# EAGLE design finis (EAGLE 9.6.2)
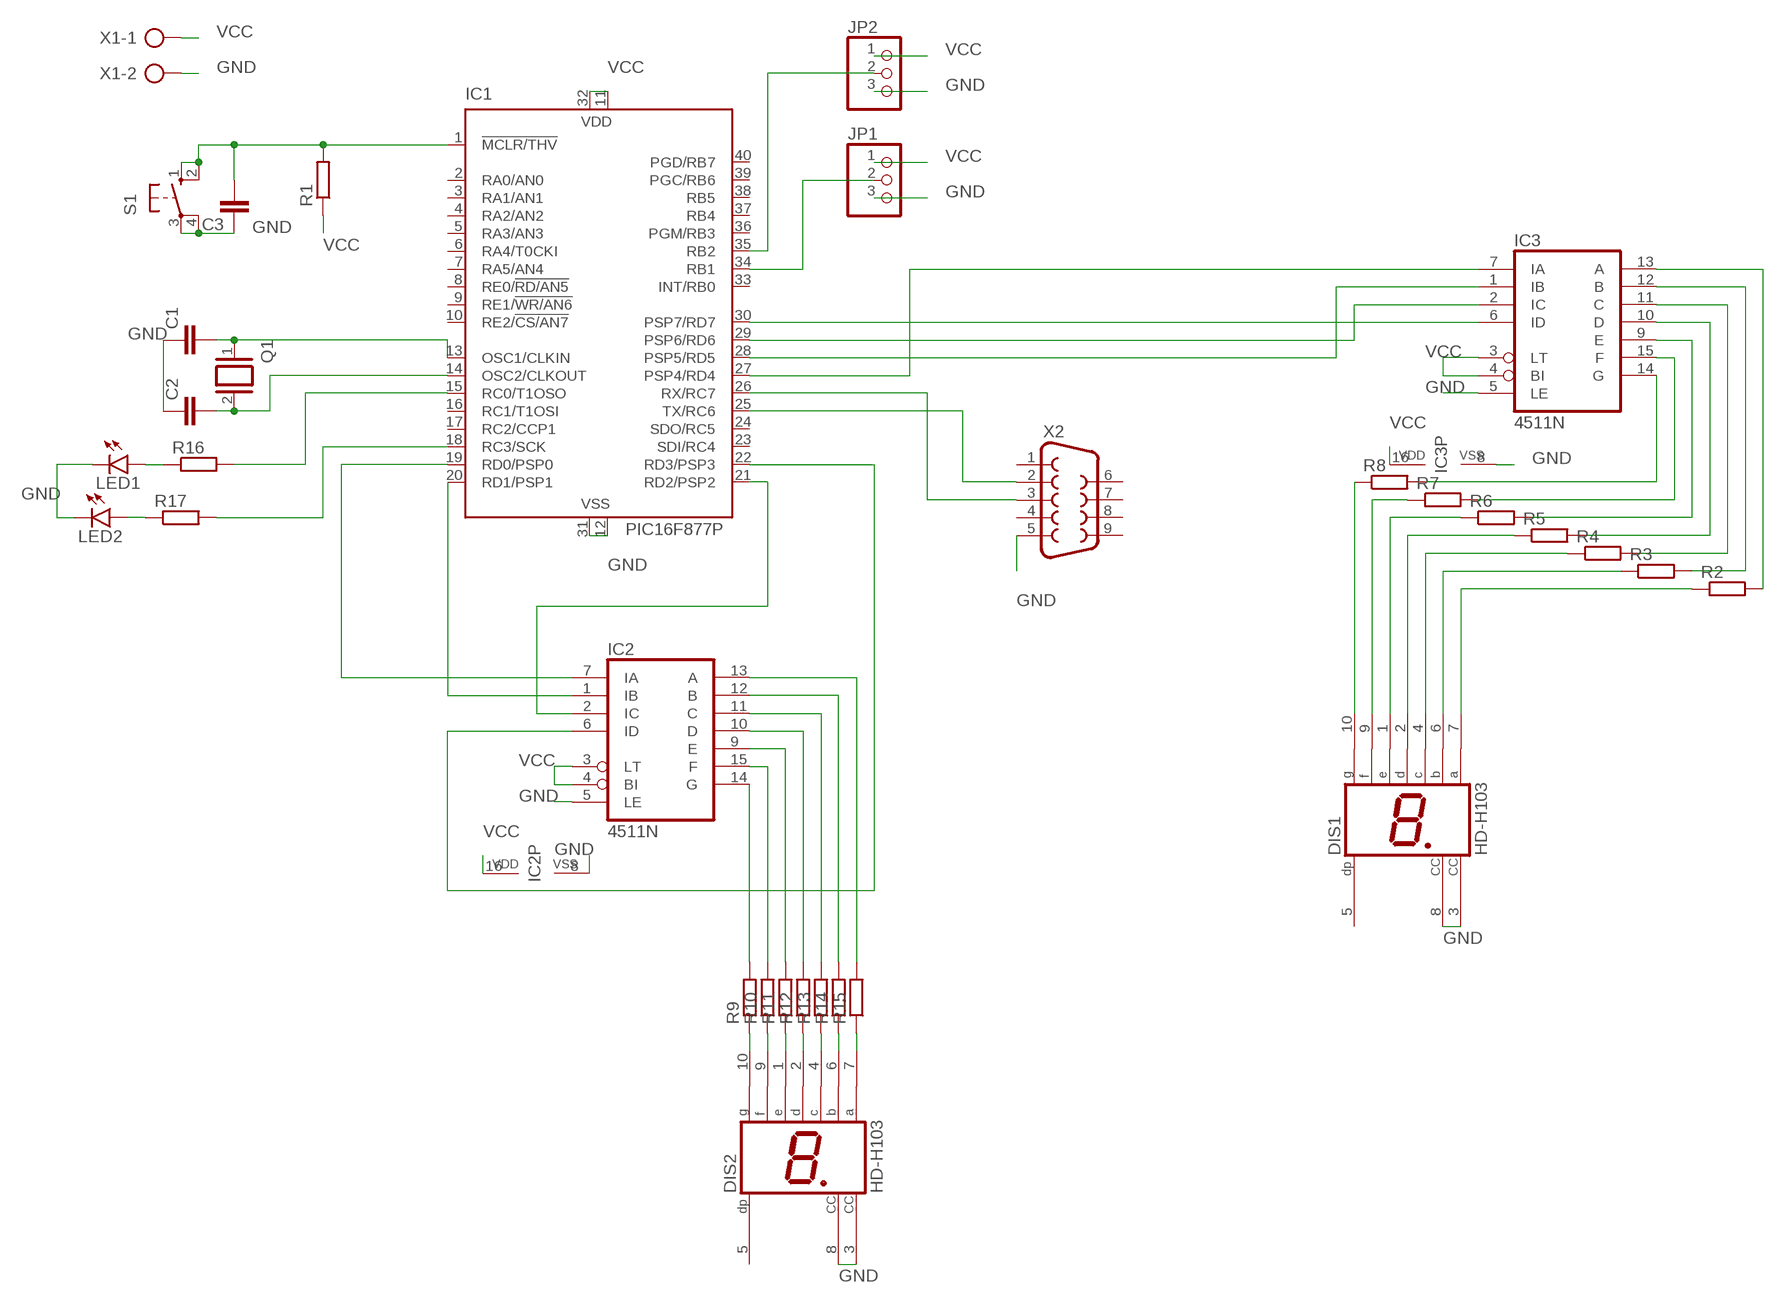
[diagram p0: schematic, sheet 1]

## Parts
C1  C-EU025-025X050  [C025-025X050]
C2  C-EU025-025X050  [C025-025X050]
C3  C-EU025-025X050  [C025-025X050]
DIS1  HD-H103  [HDSP-M]
DIS2  HD-H103  [HDSP-M]
IC1  PIC16F877P  [DIL40]
IC2  4511N  [DIL16]
IC3  4511N  [DIL16]
JP1  PINHD-1X3  [1X03]
JP2  PINHD-1X3  [1X03]
LED1  LED5MM  [LED5MM]
LED2  LED5MM  [LED5MM]
Q1  XTAL/S  [QS]
R1  R-EU_0207/10  [0207/10]
R2  R-EU_0207/10  [0207/10]
R3  R-EU_0207/10  [0207/10]
R4  R-EU_0207/10  [0207/10]
R5  R-EU_0207/10  [0207/10]
R6  R-EU_0207/10  [0207/10]
R7  R-EU_0207/10  [0207/10]
R8  R-EU_0207/10  [0207/10]
R9  R-EU_0207/10  [0207/10]
R10  R-EU_0207/10  [0207/10]
R11  R-EU_0207/10  [0207/10]
R12  R-EU_0207/10  [0207/10]
R13  R-EU_0207/10  [0207/10]
R14  R-EU_0207/10  [0207/10]
R15  R-EU_0207/10  [0207/10]
R16  R-EU_0207/10  [0207/10]
R17  R-EU_0207/10  [0207/10]
S1  10-XX  [B3F-10XX]
X1  AK300/2  [AK300/2]
X2  F09H  [F09H]

## Nets
GND: C1.1 C2.1 C3.1 DIS1.3(CC) DIS1.8(CC) DIS2.3(CC) DIS2.8(CC) IC1.12(VSS) IC1.31(VSS) IC2.5(LE) IC2.8(VSS) IC3.5(LE) IC3.8(VSS) JP1.3 JP2.3 LED1.K(C) LED2.K(C) S1.3(P) S1.4(P1) X1.2 X2.5
N$1: C1.2 IC1.13(OSC1/CLKIN) Q1.1
N$2: C2.2 IC1.14(OSC2/CLKOUT) Q1.2
N$3: C3.2 IC1.1(!MCLR/THV) R1.2 S1.1(S) S1.2(S1)
N$4: IC1.19(RD0/PSP0) IC2.7(IA)
N$5: IC1.20(RD1/PSP1) IC2.1(IB)
N$6: IC2.2(IC)
N$7: IC1.22(RD3/PSP3) IC2.6(ID)
N$8: IC1.21(RD2/PSP2)
N$9: IC1.27(PSP4/RD4) IC3.7(IA)
N$10: IC1.28(PSP5/RD5) IC3.1(IB)
N$11: IC1.29(PSP6/RD6) IC3.2(IC)
N$12: IC1.30(PSP7/RD7) IC3.6(ID)
N$13: IC3.13(A) R2.2
N$14: IC3.12(B) R3.2
N$15: IC3.11(C) R4.2
N$16: IC3.10(D) R5.2
N$17: IC3.9(E) R6.2
N$18: DIS1.9(F) R7.1
N$19: DIS1.10(G) R8.1
N$20: DIS1.7(A) R2.1
N$21: DIS1.6(B) R3.1
N$22: DIS1.4(C) R4.1
N$23: DIS1.2(D) R5.1
N$24: DIS1.1(E) R6.1
N$25: IC3.15(F) R7.2
N$26: IC3.14(G) R8.2
N$27: DIS2.10(G) R9.1
N$28: DIS2.9(F) R10.1
N$29: DIS2.1(E) R11.1
N$30: DIS2.2(D) R12.1
N$31: DIS2.4(C) R13.1
N$32: DIS2.6(B) R14.1
N$33: DIS2.7(A) R15.1
N$34: IC2.14(G) R9.2
N$35: IC2.15(F) R10.2
N$36: IC2.9(E) R11.2
N$37: IC2.10(D) R12.2
N$38: IC2.11(C) R13.2
N$39: IC2.12(B) R14.2
N$40: IC2.13(A) R15.2
N$41: LED1.A R16.1
N$42: LED2.A R17.1
N$43: IC1.18(RC3/SCK) R17.2
N$44: IC1.15(RC0/T1OSO) R16.2
N$45: IC1.25(TX/RC6) X2.2
N$46: IC1.26(RX/RC7) X2.3
N$47: IC1.35(RB2) JP2.2
N$48: IC1.34(RB1) JP1.2
VCC: IC1.11(VDD) IC1.32(VDD) IC2.3(LT) IC2.4(BI) IC2.16(VDD) IC3.3(LT) IC3.4(BI) IC3.16(VDD) JP1.1 JP2.1 R1.1 X1.1
Unconnected: DIS1.5(DP) DIS2.5(DP) IC1.2(RA0/AN0) IC1.3(RA1/AN1) IC1.4(RA2/AN2) IC1.5(RA3/AN3) IC1.6(RA4/T0CKI) IC1.7(RA5/AN4) IC1.8(RE0/!RD/AN5) IC1.9(RE1/!WR/AN6) IC1.10(RE2/!CS/AN7) IC1.16(RC1/T1OSI) IC1.17(RC2/CCP1) IC1.23(SDI/RC4) IC1.24(SDO/RC5) IC1.33(INT/RB0) IC1.36(PGM/RB3) IC1.37(RB4) IC1.38(RB5) IC1.39(PGC/RB6) IC1.40(PGD/RB7) X2.1 X2.4 X2.6 X2.7 X2.8 X2.9

## Library data of the parts
C1-C3 = rcl:C-EU: CAPACITOR, European symbol; SPICEPREFIX: C
DIS1 DIS2 = display-hp:HD-H103: LED DISPLAY 1-character 7 segment, decimal point right; OC_FARNELL: unknown; OC_NEWARK: unknown
IC1 = microchip:PIC16F87*: MICROCONTROLLER; MF: MICROCHIP; MPN: PIC16F877-04/P; OC_FARNELL: 9761349; OC_NEWARK: 61K3463
IC2 IC3 = 45xx:4511: BCD to 7-segment LATCH/DECODER/DRIVER
JP1 JP2 = pinhead:PINHD-1X3: PIN HEADER
LED1 LED2 = led:LED: LED OSRAM: - CHIPLED LG R971, LG N971, LY N971, LG Q971, LY Q971, LO R971, LY R971 LH N974, LH R974 LS Q976, LO Q976, LY Q976 LO Q996 - Hyper CHIPLED LW Q18S LB Q993, LB Q99A, LB R99A - SideLED LS A670, LO A670, LY A670, LG A670, LP A670 LB A673, LV A673, LT A673, LW A673 LH A674 LY A675 LS A676, LA A676, LO A676, LY A676, LW A676 LS A679, LY A679, LG A679 - Hyper Micro SIDELED® LS Y876, LA Y876, LO Y876, LY Y876 LT Y87S - SmartLED LW L88C, LW L88S LB L89C, LB L89S, LG L890 LS L89K, LO L89K, LY L89K LS L896, LA L896, LO L896, LY L896 - TOPLED LS T670, LO T670, LY T670, LG T670, LP T670 LSG T670, LSP T670, LSY T670, LOP T670, LYG T670 LG T671, LOG T671, LSG T671 LB T673, LV T673, LT T673, LW T673 LH T674 LS T676, LA T676, LO T676, LY T676, LB T676, LH T676, LSB T676, LW T676 LB T67C, LV T67C, LT T67C, LS T67K, LO T67K, LY T67K, LW E67C LS E67B, LA E67B, LO E67B, LY E67B, LB E67C, LV E67C, LT E67C LW T67C LS T679, LY T679, LG T679 LS T770, LO T770, LY T770, LG T770, LP T770 LB T773, LV T773, LT T773, LW T773 LH T774 LS E675, LA E675, LY E675, LS T675 LS T776, LA T776, LO T776, LY T776, LB T776 LHGB T686 LT T68C, LB T68C - Hyper Mini TOPLED® LB M676 - Mini TOPLED Santana® LG M470 LS M47K, LO M47K, LY M47K Source: http://www.osram.convergy.de LUXEON: - LUMILED® LXK2-PW12-R00, LXK2-PW12-S00, LXK2-PW14-U00, LXK2-PW14-V00 LXK2-PM12-R00, LXK2-PM12-S00, LXK2-PM14-U00 LXK2-PE12-Q00, LXK2-PE12-R00, LXK2-PE12-S00, LXK2-PE14-T00, LXK2-PE14-U00 LXK2-PB12-K00, LXK2-PB12-L00, LXK2-PB12-M00, LXK2-PB14-N00, LXK2-PB14-P00, LXK2-PB14-Q00 LXK2-PR12-L00, LXK2-PR12-M00, LXK2-PR14-Q00, LXK2-PR14-R00 LXK2-PD12-Q00, LXK2-PD12-R00, LXK2-PD12-S00 LXK2-PH12-R00, LXK2-PH12-S00 LXK2-PL12-P00, LXK2-PL12-Q00, LXK2-PL12-R00 Source: www.luxeon.com KINGBRIGHT: KA-3528ASYC Source: www.kingbright.com
Q1 = special:XTAL/S: CRYSTAL
R1-R17 = rcl:R-EU_: RESISTOR, European symbol; SPICEPREFIX: R
S1 = switch-omron:10-XX: OMRON SWITCH; MPN: B3F-1000; OC_FARNELL: 176432; OC_NEWARK: 36M3542
X1 = con-ptr500:AK300/2: CONNECTOR; OC_FARNELL: unknown; OC_NEWARK: unknown
X2 = con-subd:F09: SUB-D; OC_FARNELL: unknown; OC_NEWARK: unknown

## Board
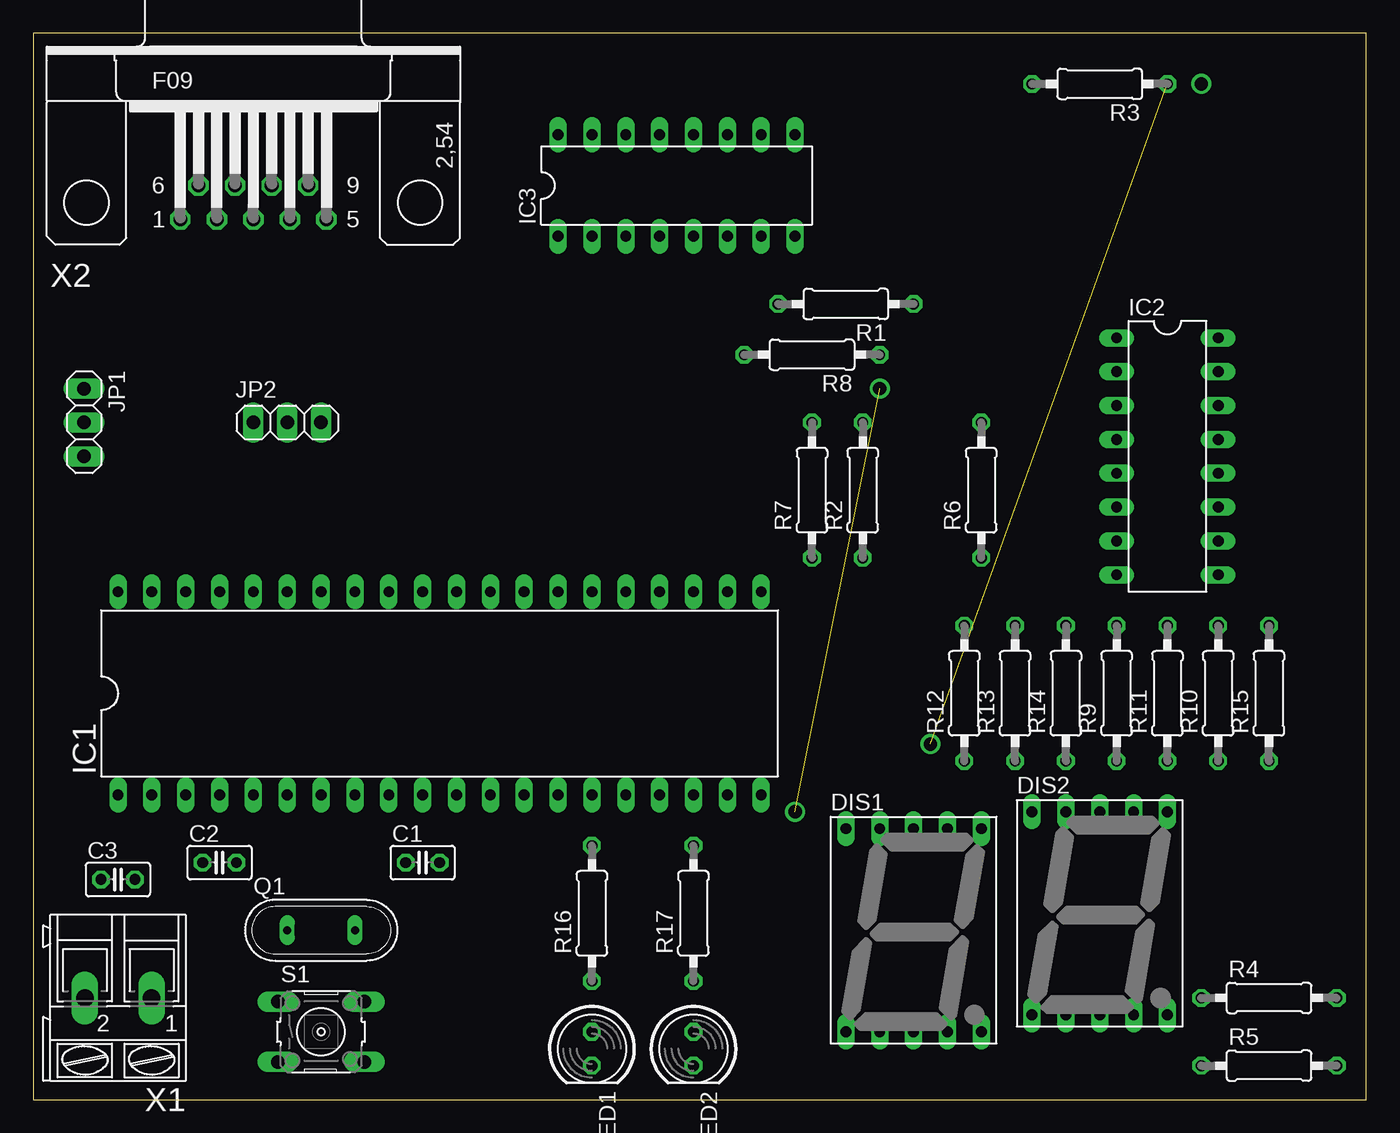
[diagram p1: board, top side]
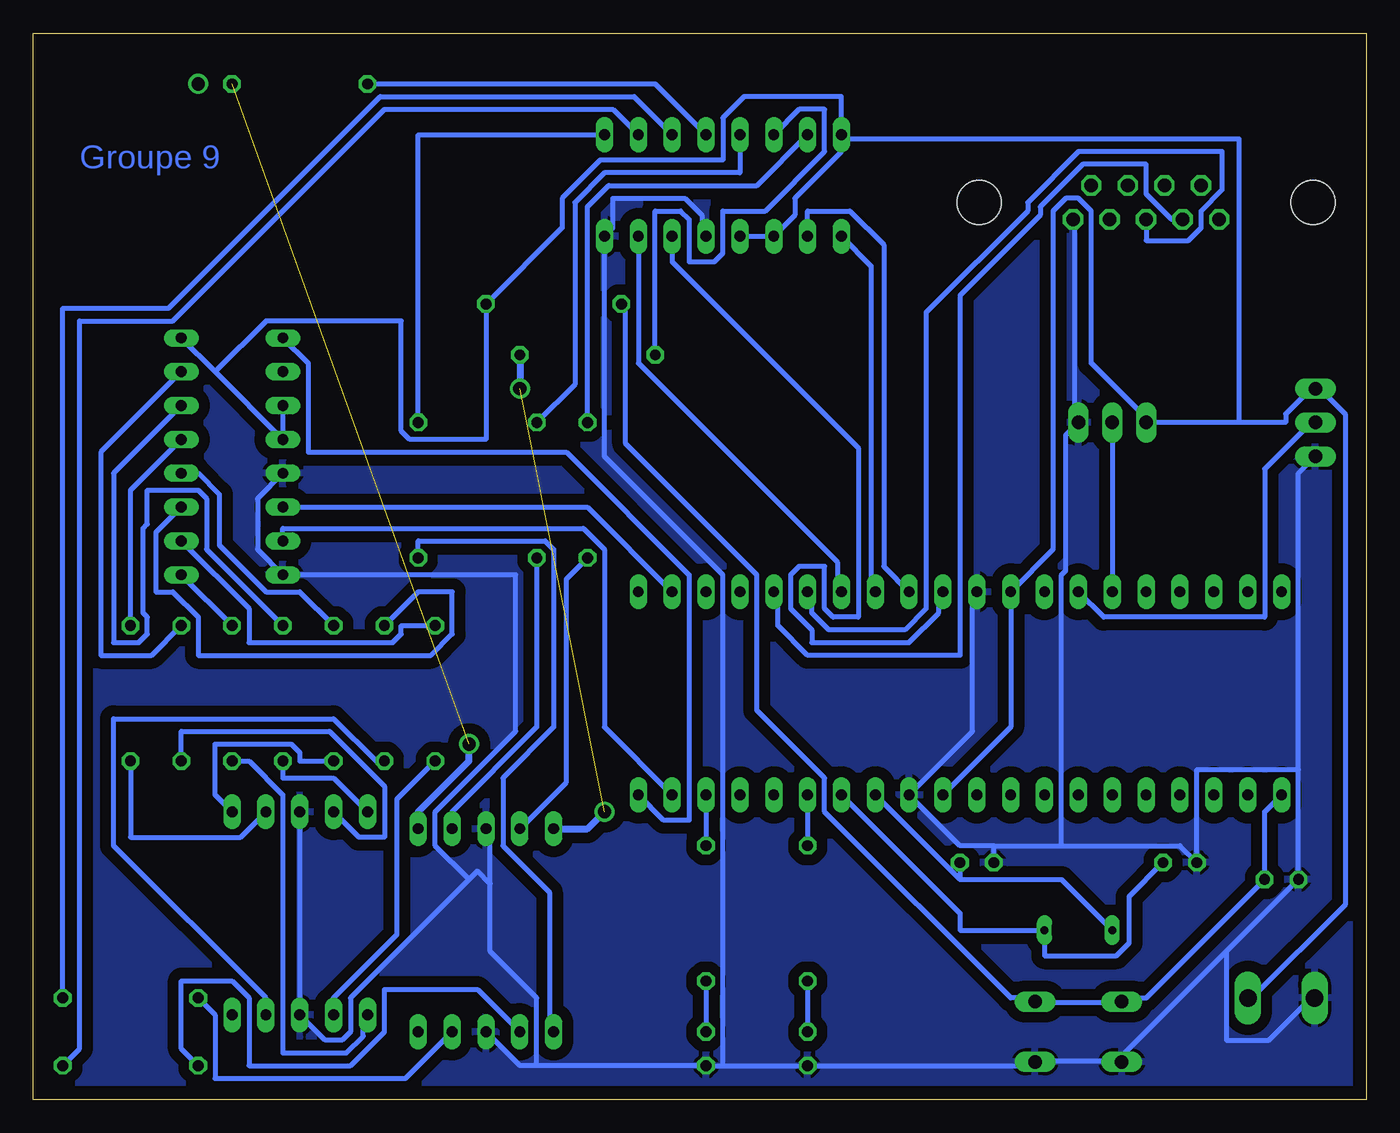
[diagram p2: board, bottom side, seen from below]

Size 100 x 80 mm. Coordinates in mm from the lower left corner, seen from the top.
Outline: 0,0 100,0 100,80 0,80 0,0
Copper layers (1*16): Top 0.035mm / dielectric 1.5mm / Bottom 0.035mm
Design rules "default *": minimum track width 15mil, minimum drill 0.35mm, track to track 15mil, track to pad 15mil, pad to pad 15mil, via to via 15mil, smd to smd 6mil, copper to edge 40mil, drill to drill 6mil, minimum pad ring 10mil, minimum via ring 8mil, stop-mask expansion 4mil, vias tented up to drill 0mil, thermal gap 10mil

### Footprints (pad centres in the part's own frame; a part is rotated, then mirrored left to right if it is on the bottom)
C025-025X050 = drill 0.813 octagon: 1 -1.27,0; 2 1.27,0
HDSP-M = drill 0.813 long: 1 -5.08,-7.62; 2 -2.54,-7.62; 3 0,-7.62; 4 2.54,-7.62; 5 5.08,-7.62; 6 5.08,7.62; 7 2.54,7.62; 8 0,7.62; 9 -2.54,7.62; 10 -5.08,7.62
DIL40 = drill 0.813 long: 1 -24.13,-7.62; 2 -21.59,-7.62; 3 -19.05,-7.62; 4 -16.51,-7.62; 5 -13.97,-7.62; 6 -11.43,-7.62; 7 -8.89,-7.62; 8 -6.35,-7.62; 9 -3.81,-7.62; 10 -1.27,-7.62; 11 1.27,-7.62; 12 3.81,-7.62; 13 6.35,-7.62; 14 8.89,-7.62; 15 11.43,-7.62; 16 13.97,-7.62; 17 16.51,-7.62; 18 19.05,-7.62; 19 21.59,-7.62; 20 24.13,-7.62; 21 24.13,7.62; 22 21.59,7.62; 23 19.05,7.62; 24 16.51,7.62; 25 13.97,7.62; 26 11.43,7.62; 27 8.89,7.62; 28 6.35,7.62; 29 3.81,7.62; 30 1.27,7.62; 31 -1.27,7.62; 32 -3.81,7.62; 33 -6.35,7.62; 34 -8.89,7.62; 35 -11.43,7.62; 36 -13.97,7.62; 37 -16.51,7.62; 38 -19.05,7.62; 39 -21.59,7.62; 40 -24.13,7.62
DIL16 = drill 0.813 long: 1 -8.89,-3.81; 2 -6.35,-3.81; 3 -3.81,-3.81; 4 -1.27,-3.81; 5 1.27,-3.81; 6 3.81,-3.81; 7 6.35,-3.81; 8 8.89,-3.81; 9 8.89,3.81; 10 6.35,3.81; 11 3.81,3.81; 12 1.27,3.81; 13 -1.27,3.81; 14 -3.81,3.81; 15 -6.35,3.81; 16 -8.89,3.81
1X03 = drill 1.016 long: 1 -2.54,0; 2 0,0; 3 2.54,0
LED5MM = drill 0.813 octagon: A -1.27,0; K 1.27,0
QS = drill 0.61 long: 1 -2.54,0; 2 2.54,0
0207/10 = drill 0.813 octagon: 1 -5.08,0; 2 5.08,0
B3F-10XX = drill 1.016 long: 1 -3.251,2.261; 2 3.251,2.261; 3 -3.251,-2.261; 4 3.251,-2.261
AK300/2 = drill 1.321 long: 1 -2.515,0; 2 2.489,0
F09H = drill 1.016 octagon: 1 -5.486,-1.27; 2 -2.743,-1.27; 3 0,-1.27; 4 2.743,-1.27; 5 5.486,-1.27; 6 -4.115,1.27; 7 -1.372,1.27; 8 1.372,1.27; 9 4.115,1.27 | hole 3.302: -12.522,0; 12.522,0

### Placement (x,y rotation side)
C1  29.21,17.78 0 top
C2  13.97,17.78 0 top
C3  6.35,16.51 0 top
DIS1  66.04,12.7 0 top
DIS2  80.01,13.97 0 top
IC1  30.48,30.48 0 top
IC2  85.09,48.26 270 top
IC3  48.26,68.58 0 top
JP1  3.81,50.8 270 top
JP2  19.05,50.8 0 top
LED1  41.91,3.81 270 top
LED2  49.53,3.81 270 top
Q1  21.59,12.7 0 top
R1  60.96,59.69 180 top
R2  62.23,45.72 90 top
R3  80.01,76.2 180 top
R4  92.71,7.62 0 top
R5  92.71,2.54 0 top
R6  71.12,45.72 90 top
R7  58.42,45.72 90 top
R8  58.42,55.88 180 top
R9  81.28,30.48 90 top
R10  88.9,30.48 90 top
R11  85.09,30.48 90 top
R12  69.85,30.48 90 top
R13  73.66,30.48 90 top
R14  77.47,30.48 90 top
R15  92.71,30.48 90 top
R16  41.91,13.97 90 top
R17  49.53,13.97 90 top
S1  21.59,5.08 0 top
X1  6.35,7.62 180 top
X2  16.51,67.31 0 top

### Tracks (layer width: path | path; a pad name or v marks a point on that pad's centre or on a via)
GND
  Bottom 0.381: 10.48,11.11 18.1,3.49 18.1,2.86 S1.3 18.41,2.86 24.77,2.86 S1.4 25.08,2.54 LED1.K 48.26,2.54 | 10.48,11.11 C3.1 5.08,24.77 | JP1.3 5.08,46.99 5.08,24.77 | 10.48,11.11 10.48,4.45 7.3,4.45 4.13,7.62 X1.2 | X2.5 21.91,66.04 21.91,51.12 JP2.3 22.54,49.85 22.54,39.69 22.86,39.37 22.86,19.05 | 27.94,19.05 22.86,19.05 | 22.86,19.05 13.97,19.05 C2.1 12.7,24.77 5.08,24.77 | C1.1 27.94,19.05 | 27.94,19.05 30.48,19.05 IC1.12 29.53,27.62 29.53,37.78 IC1.31 | DIS2.8 DIS2.3 78.11,4.45 76.83,4.45 76.2,5.08 76.2,7.62 67.31,16.51 | IC3.5 49.85,65.09 49.85,66.36 51.12,67.63 56.52,67.63 56.52,65.41 IC3.8 57.15,48.26 48.26,39.37 48.26,2.54 | IC2.5 83.19,45.09 83.19,41.27 IC2.8 63.82,39.37 63.82,27.62 69.85,21.59 69.85,19.05 67.31,16.51 | 48.26,2.54 LED2.K 62.23,2.54 | DIS1.3 63.5,2.54 62.23,2.54 | DIS1.8 65.72,20 65.72,16.19 | 65.72,16.19 65.72,11.11 62.23,7.62 62.23,2.54 | 65.72,16.19 66.67,17.14 67.31,16.51
  pour Bottom (isolate 0.813): 0,80.01 100.33,80.01 100.33,0 0,0
N$1
  Bottom 0.381: Q1.1 22.86,16.51 30.48,16.51 | C1.2 30.48,16.51 | 30.48,16.51 IC1.13
N$2
  Bottom 0.381: IC1.14 30.48,13.97 30.48,12.7 Q1.2 24.13,10.79 18.73,10.79 17.78,11.75 17.78,15.24 C2.2
N$3
  Bottom 0.381: IC1.1 7.62,21.59 C3.2 16.51,7.62 18.1,7.62 S1.1 18.41,7.3 24.77,7.3 S1.2 25.08,7.62 26.67,7.62 40.64,21.59 40.64,24.13 45.72,29.21 45.72,39.37 55.56,49.21 55.56,59.37 R1.2
N$4
  Bottom 0.381: IC1.19 57.15,27.94 57.15,41.27 58.74,42.86 81.28,42.86 IC2.7
N$5
  Bottom 0.381: IC1.20 52.7,20.95 50.8,20.95 50.8,39.37 60.01,48.58 79.38,48.58 79.38,55.24 IC2.1
N$7
  Bottom 0.381: IC1.22 58.42,44.45 IC2.6
N$9
  Bottom 0.381: IC1.27 39.69,38.42 39.69,40.32 54.61,55.24 IC3.7
N$10
  Bottom 0.381: IC1.28 37.15,38.42 37.15,62.55 IC3.1
N$11
  Bottom 0.381: IC1.29 36.2,40.01 36.2,64.14 38.73,66.67 41.91,66.67 IC3.2
N$12
  Bottom 0.381: IC1.30 32.07,37.78 32.07,36.51 34.29,34.29 41.59,34.29 41.59,35.24 43.18,36.83 43.18,39.37 42.55,40.01 40.64,40.01 40.64,36.83 40.01,36.2 38.1,36.2 38.1,48.9 52.07,62.87 IC3.6
N$13
  Bottom 0.381: R2.2 59.37,53.66 59.37,67.31 57.15,69.53 46.99,69.53 IC3.13
N$14
  Bottom 0.381: IC3.12 53.34,76.2 R3.2
N$15
  Bottom 0.381: IC3.11 54.93,75.25 73.98,75.25 89.85,59.37 97.79,59.37 R4.2
N$16
  Bottom 0.381: IC3.10 56.52,74.3 73.66,74.3 89.53,58.42 96.52,58.42 96.52,3.81 R5.2
N$17
  Bottom 0.381: IC3.9 71.12,72.39 R6.2
N$18
  Bottom 0.381: R7.1 60.01,39.05 60.01,23.81 DIS1.9
N$19  (1 unrouted)
  Bottom 0.508: DIS1.10 58.42,20.32 57.15,21.59 | R8.1 63.5,53.34
N$20
  Bottom 0.381: DIS1.7 68.58,21.59 62.23,27.94 R2.1
N$21  (1 unrouted)
  Bottom 0.508: DIS1.6 71.12,21.59 67.31,25.4 67.31,26.67
N$22
  Bottom 0.381: DIS1.4 72.07,1.59 86.36,1.59 86.36,6.35 R4.1
N$23
  Bottom 0.381: DIS1.2 66.67,8.26 73.66,8.26 73.66,5.08 76.2,2.54 83.82,2.54 83.82,7.62 85.09,8.89 88.9,8.89 88.9,3.81 R5.1
N$24
  Bottom 0.381: DIS1.1 61.28,5.4 61.28,15.56 64.77,19.05 64.77,24.13 60.96,27.94 60.96,41.27 61.59,41.91 71.12,41.91 R6.1
N$25
  Bottom 0.381: IC3.15 45.72,68.58 56.83,68.58 58.42,66.99 R7.2
N$26
  Bottom 0.381: IC3.14 42.55,74.3 40.64,74.3 40.64,71.12 45.09,66.67 48.26,66.67 48.26,63.5 48.9,62.87 50.8,62.87 50.8,66.04 51.44,66.67 53.34,66.67 R8.2
N$27
  Bottom 0.381: DIS2.10 77.47,24.13 81.28,24.13 R9.1
N$28
  Bottom 0.381: DIS2.9 75.56,19.68 73.66,19.68 73.66,23.5 77.79,27.62 88.9,27.62 R10.1
N$29
  Bottom 0.381: DIS2.1 75.25,6.03 75.25,4.76 76.52,3.49 81.28,3.49 81.28,22.86 83.82,25.4 R11.1
N$30
  Bottom 0.381: R12.1 72.71,22.54 72.71,12.38 77.47,7.62 DIS2.2
N$31
  Bottom 0.381: R13.1 74.3,25.4 77.47,28.57 93.98,28.57 93.98,19.05 82.55,7.62 DIS2.4
N$32
  Bottom 0.381: R14.1 80.01,25.4 80.01,26.04 80.64,26.67 86.36,26.67 86.36,22.86 DIS2.6
N$33
  Bottom 0.381: DIS2.7 84.45,19.68 92.71,19.68 R15.1
N$34
  Bottom 0.381: R9.2 87,41.27 87,45.09 87.63,45.72 91.44,45.72 91.44,43.18 91.76,42.86 91.76,36.51 91.44,36.2 91.44,34.92 92.08,34.29 93.98,34.29 93.98,46.99 IC2.14
N$35
  Bottom 0.381: R10.2 91.12,33.34 94.93,33.34 94.93,48.58 IC2.15
N$36
  Bottom 0.381: IC2.9 R11.2
N$37
  Bottom 0.381: R12.2 72.39,35.56 72.39,34.92 73.03,34.29 83.82,34.29 83.82,36.83 IC2.10
N$38
  Bottom 0.381: R13.2 71.12,38.1 68.58,38.1 68.58,34.92 70.17,33.34 87.63,33.34 87.63,36.2 89.53,38.1 90.81,38.1 90.81,42.55 IC2.11
N$39
  Bottom 0.381: R14.2 80.01,38.1 82.55,38.1 86.04,41.59 86.04,45.4 87.63,46.99 IC2.12
N$40
  Bottom 0.381: IC2.13 92.71,45.72 R15.2
N$41
  Bottom 0.381: R16.1 LED1.A
N$42
  Bottom 0.381: R17.1 LED2.A
N$43
  Bottom 0.381: IC1.18 R17.2
N$44
  Bottom 0.381: IC1.15 R16.2
N$45
  Bottom 0.381: IC1.25 44.13,37.78 44.13,35.56 41.91,33.34 30.48,33.34 30.48,60.33 24.45,66.36 24.45,66.99 21.27,70.17 16.51,70.17 16.51,67.94 14.61,66.04 X2.2
N$46
  Bottom 0.381: IC1.26 41.59,37.78 41.59,36.51 40.32,35.24 34.61,35.24 33.02,36.83 33.02,59.05 25.4,66.67 25.4,67.31 21.59,71.12 10.79,71.12 10.79,68.26 12.38,66.67 12.38,65.41 13.34,64.45 16.51,64.45 X2.3
N$47
  Bottom 0.381: JP2.2 IC1.35
N$48
  Bottom 0.381: IC1.34 19.68,36.2 7.62,36.2 7.62,47.31 4.13,50.8 JP1.2
N$49  (via drill 1 pad 1.3)
  other vias: 67.31,26.67
N$50  (via drill 1 pad 1.3)
  other vias: 87.63,76.2
N$51  (via drill 1 pad 1.3)
  other vias: 63.5,53.34
N$52  (via drill 1 pad 1.3)
  other vias: 57.15,21.59
VCC
  Bottom 0.381: IC2.3 IC2.4 86.36,54.61 | 86.36,54.61 IC2.16 | IC3.4 IC3.3 42.86,66.36 42.86,67.63 39.37,71.12 39.37,72.07 | 86.36,54.61 82.55,58.42 72.39,58.42 72.39,50.16 71.75,49.53 66.04,49.53 R1.1 60.33,65.41 60.33,67.63 57.47,70.48 48.26,70.48 48.26,73.66 46.67,75.25 39.37,75.25 IC3.16 39.37,72.07 | IC1.11 26.67,27.94 IC1.32 23.5,41.27 23.5,66.67 22.54,67.63 21.59,67.63 20.64,66.67 20.64,55.24 16.51,51.12 JP2.1 9.53,50.8 | 9.53,50.8 6.03,50.8 6.03,51.44 4.13,53.34 JP1.1 3.49,53.34 1.59,51.44 1.59,14.61 8.57,7.62 X1.1 | 39.37,72.07 9.53,72.07 9.53,50.8

### Text on the board
Bottom: Groupe 9